# Altium schematic sheet 03_I2S.SchDoc: =GlobalProjectName
size 594 x 420 mm; CheckedBy: A_D; Author: A_D; SheetNumber: 3; SheetTotal: 4; PageSetup: Record=PageOptions|CenterHorizontal=True|CenterVertical=True|PrintScale=0.70|XCorrection=1.00|YCorrection=1.00|PrintKind=2|BorderSize=5000000|LeftOffset=9000|BottomOffset=10100|Orientation=2|PaperLength=11176|PaperWidth=8636|Scale=100|PaperSource=259|PrintQuality=-3|MediaType=1|DitherType=10|PrintScaleMode=1|PaperKind=A3|PaperIndex=8
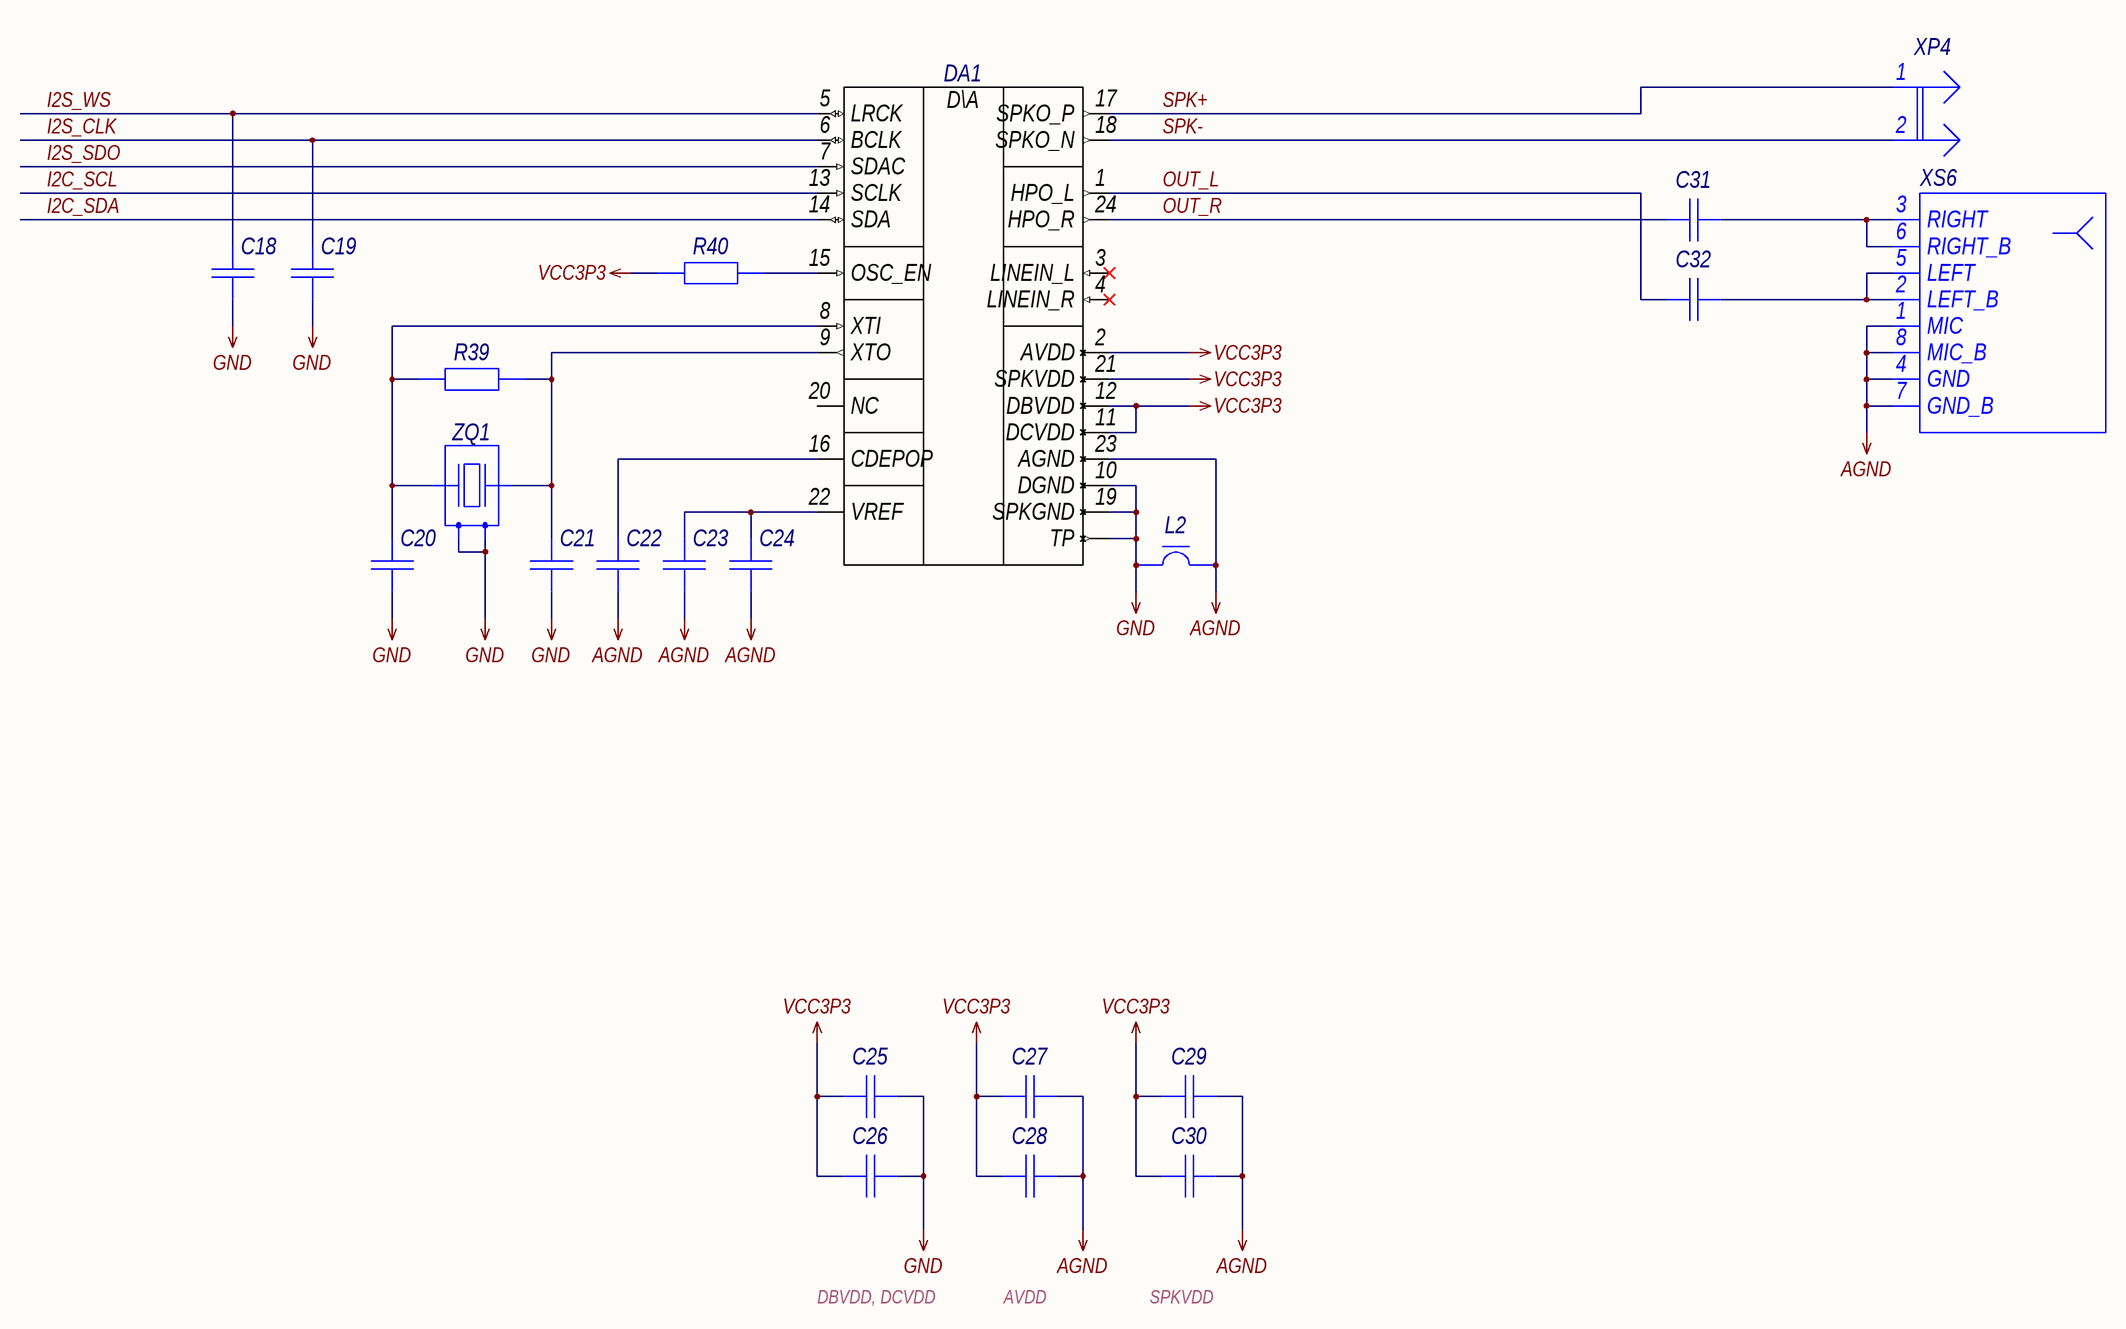
[diagram p0: 03_I2S.SchDoc]

## Parts
C18  Capacitor  [C0603_L]  (value not drawn)
C19  Capacitor  [C0603_L]  (value not drawn)
C20  Capacitor  [C0603_L]  (value not drawn)
C21  Capacitor  [C0603_L]  (value not drawn)
C22  Capacitor  [C0603_L]  (value not drawn)
C23  Capacitor  [C0603_L]  (value not drawn)
C24  Capacitor  [C0603_L]  (value not drawn)
C25  Capacitor  [C0603_L]  (value not drawn)
C26  Capacitor  [C0603_L]  (value not drawn)
C27  Capacitor  [C0603_L]  (value not drawn)
C28  Capacitor  [C0603_L]  (value not drawn)
C29  Capacitor  [C0603_L]  (value not drawn)
C30  Capacitor  [C0603_L]  (value not drawn)
C31  Capacitor  [C1210_L]  (value not drawn)
C32  Capacitor  [C1210_L]  (value not drawn)
DA1  ALC5628  [QFN-24_050P400X400X090_N]  (value not drawn)
L2  FerriteBead  [L0603_L]  (value not drawn)
R39  Resistor  [R0603_L]  (value not drawn)
R40  Resistor  [R0603_L]  (value not drawn)
XP4  SPK  [MW-2M]  (value not drawn)
XS6  OUT  [PJ30930-Series]  (value not drawn)
ZQ1  Crystal-1_3p_S  [SMD 3.2x2.5mm]  (value not drawn)

## Nets
AGND: C22.1 C23.1 C24.1 C27.2 C28.2 C29.2 C30.2 DA1.23(AGND) L2.2 XS6.1(MIC) XS6.4(GND) XS6.7(GND_B) XS6.8(MIC_B)
GND: C18.1 C19.1 C20.1 C21.1 C25.2 C26.2 DA1.10(DGND) DA1.19(SPKGND) DA1.TP L2.1 ZQ1.2 ZQ1.4
VCC3P3: C25.1 C26.1 C27.1 C28.1 C29.1 C30.1 DA1.2(AVDD) DA1.11(DCVDD) DA1.12(DBVDD) DA1.21(SPKVDD) R40.1
I2C_SCL: DA1.13(SCLK)
I2C_SDA: DA1.14(SDA)
I2S_CLK: C19.2 DA1.6(BCLK)
I2S_SDO: DA1.7(SDAC)
I2S_WS: C18.2 DA1.5(LRCK)
OUT_L: C32.1 DA1.1(HPO_L)
OUT_R: C31.1 DA1.24(HPO_R)
SPK+: DA1.17(SPKO_P) XP4.1
SPK-: DA1.18(SPKO_N) XP4.2
NetC20_2: C20.2 DA1.8(XTI) R39.1 ZQ1.1
NetC21_2: C21.2 DA1.9(XTO) R39.2 ZQ1.3
NetC22_2: C22.2 DA1.16(CDEPOP)
NetC23_2: C23.2 C24.2 DA1.22(VREF)
NetC31_2: C31.2 XS6.3(RIGHT) XS6.6(RIGHT_B)
NetC32_2: C32.2 XS6.2(LEFT_B) XS6.5(LEFT)
NetDA1_15: DA1.15(OSC_EN) R40.2

Not connected (* = marked no-connect by the designer): DA1 3(LINEIN_L)* 4(LINEIN_R)* 20(NC)

## Notes on the sheet
- DBVDD, DCVDD
- AVDD
- SPKVDD
- Подп. и дата
- Инв. № дубл.
- Взам. инв. №
- Инв. № подл.
- Изм.
- Лист
- № докум.
- Подп.
- Дата
- Форма 2а ГОСТ 2.104-2006
- Копировал
- Формат А2
- (in symbol ALC5628-GR) D\A

## Library data of the parts
C18 C19 = GRM1885C1H220JA01D: Manufacturer: Murata; Type: Конденсатор; ID: 122; Value: 22pF; Voltage: 50V; Tolerance: ±5%; Dielectric Type: NP0; Application Category: 1; Working Temperature Min: -55°С; Working Temperature Max: +125°С; Published: 18.05.2010; Publisher: Andrew Danich; Part Number: GRM1885C1H220JA01D; Footprint: 0603
C20 C21 = GCM1885C2A120JA16D: Manufacturer: Murata; Type: Конденсатор; ID: 121; Value: 12pF; Voltage: 100V; Tolerance: ±5%; Dielectric Type: NP0; Application Category: 1; Working Temperature Min: -55°С; Working Temperature Max: +125°С; Published: 18.05.2010; Publisher: Andrew Danich; Part Number: GCM1885C2A120JA16D; Footprint: 0603
C22 C25 C27 = GCM188R71E105KA64D: Manufacturer: Murata; Type: Конденсатор; ID: 134; Value: 1uF; Voltage: 25V; Tolerance: ±10%; Dielectric Type: X7R; Application Category: 1; Working Temperature Min: -55°С; Working Temperature Max: +85°С; Published: 18.05.2010; Publisher: Andrew Danich; Part Number: GCM188R71E105KA64D; Footprint: 0603
C23 = GRM188R72A104KA35D: Manufacturer: Murata; Type: Конденсатор; ID: 232; Value: 0.1uF; Voltage: 100V; Tolerance: ±10%; Dielectric Type: X7R; Application Category: 1; Working Temperature Min: -55°С; Working Temperature Max: +125°С; Published: 18.05.2010; Publisher: Andrew Danich; Part Number: GRM188R72A104KA35D; Footprint: 0603
C24 = GRT188C81E475KE13D: Manufacturer: Murata; Type: Конденсатор; ID: 175; Value: 4.7uF; Voltage: 25V; Tolerance: ±20%; Dielectric Type: X6S; Application Category: 1; Working Temperature Min: -55°С; Working Temperature Max: +105°С; Published: 18.05.2010; Publisher: Andrew Danich; Part Number: GRT188C81E475KE13D; Footprint: 0603
C26 C28 C30 = GRM1885C2A102JA01D: Manufacturer: Murata; Type: Конденсатор; ID: 135; Value: 1000pF; Voltage: 100V; Tolerance: ±5%; Dielectric Type: NP0; Application Category: 1; Working Temperature Min: -55°С; Working Temperature Max: +125°С; Published: 18.05.2010; Publisher: Andrew Danich; Part Number: GRM1885C2A102JA01D; Footprint: 0603
C29 = GRM188R61A106KE69D: Manufacturer: Murata; Type: Конденсатор; ID: 173; Value: 10uF; Voltage: 10V; Tolerance: ±10%; Dielectric Type: X5R; Application Category: 1; Working Temperature Min: -55°С; Working Temperature Max: +85°С; Published: 18.05.2010; Publisher: Andrew Danich; Part Number: GRM188R61A106KE69D; Footprint: 0603
C31 C32 = GRM32ER60J107ME20L: Manufacturer: Murata; Type: Конденсатор; ID: 174; Value: 100uF; Voltage: 6.3V; Tolerance: ±20%; Dielectric Type: X5R; Application Category: 1; Working Temperature Min: -55°С; Working Temperature Max: +85°С; Published: 18.05.2010; Publisher: Andrew Danich; Part Number: GRM32ER60J107ME20L; Footprint: 1210
DA1 = ALC5628-GR: Manufacturer: Realtek; ID: 8; Supply Operation: +2.3…3.6V; Channel: 2; THD: -86dB; Interface: I2S/PCM; Application Category: 1; Working Temperature Min: -20°С; Working Temperature Max: +85°С; Functional Analog: ALC5628-GRT; Type: Микросхема; Published: 06.09.2018; Publisher: Andrew Danich; Part Number: ALC5628-GR; Value: ALC5628-GR
L2 = BLM18PG121SN1: Manufacturer: Murata; Type: Дроссель; ID: 4; Rated Current: 2A; Impedance at 100Mhz: 120ohm; DC Resistance: 0.05ohm; Inductor Type: EMIFIL; Application Category: 1; Working Temperature Min: -55°С; Working Temperature Max: +125°С; Published: 14.11.2014; Publisher: Andrew Danich; Part Number: BLM18PG121SN1; Value: BLM18PG121SN1; Footprint: 0603; ClassName: DirectConnect
R39 = RC0603JR-071ML: Manufacturer: Yageo; ID: 20; Value: 1meg; Limit Voltage: 50V; Tolerance: ±5%; Temperature Coefficient: 100ppm; Total Power Dissipation: 0.1W; Series Type: Thick-Film; Application Category: 1; Working Temperature Min: -55°С; Working Temperature Max: +155°С; Published: 24.03.2010; Publisher: Andrew Danich; Type: Резистор; Part Number: RC0603JR-071ML; Footprint: 0603
R40 = RC0603JR-070R: Manufacturer: Yageo; ID: 5; Value: 0; Limit Voltage: 50V; Tolerance: ±5%; Temperature Coefficient: 100ppm; Total Power Dissipation: 0.1W; Series Type: Thick-Film; Application Category: 1; Working Temperature Min: -55°С; Working Temperature Max: +155°С; Functional Analog: RC0603FR-070RL, CR0603-J/-000E; Published: 24.03.2010; Publisher: Andrew Danich; Type: Резистор; Part Number: RC0603JR-070R; Footprint: 0603
XP4 = MW-2M: Value: MW-2M; ID: 60; Limit Voltage: 100V; Limit Current: 2A; Connector Type: Male; Resistance: 20mohm; Surface Finish: Phosphor Bronze; Pitch: 2mm; Application Category: 1; Published: 07.03.2013; Publisher: Andrew Danich; Type: Вилка; Part Number: MW-2M; Pins: 2
XS6 = PJ30930-Q-LC0AG00TR-7260: Manufacturer: Dongnan Electronics; ID: 11; Limit Voltage: 30V; Limit Current: 0.5A; Connector Type: Female; Standart: 3.5 mm; Application Category: 1; Working Temperature Min: -25°С; Working Temperature Max: +85°С; Functional Analog: PJ30930-Q-LC0AG00-7260; Value: PJ30930-Q-LC0AG00TR-7260; Published: 06.09.2018; Publisher: Andrew Danich; Type: Розетка; Part Number: PJ30930-Q-LC0AG00TR-7260; Pins: 8; Mount Type: Surface
ZQ1 = MCSJK-7U-24.576-12-30-60-B-30: Manufacturer: Multicomp; ID: 27; Output Frequency: 24.576МГц; Load Capacitance: 12pF; Temperature Coefficient: ±30ppm; Application Category: 1; Working Temperature Min: -20°С; Working Temperature Max: +70°С; Published: 06.09.2018; Publisher: Andrew Danich; Type: Резонатор; Part Number: MCSJK-7U-24.576-12-30-60-B-30; Value: MCSJK-7U-24.576-12-30-60-B-30; Functional Analog: -